# Altium schematic sheet ADF7020BCPZ-RL.SchDoc
size A3; SheetNumber: 9; SheetTotal: 9
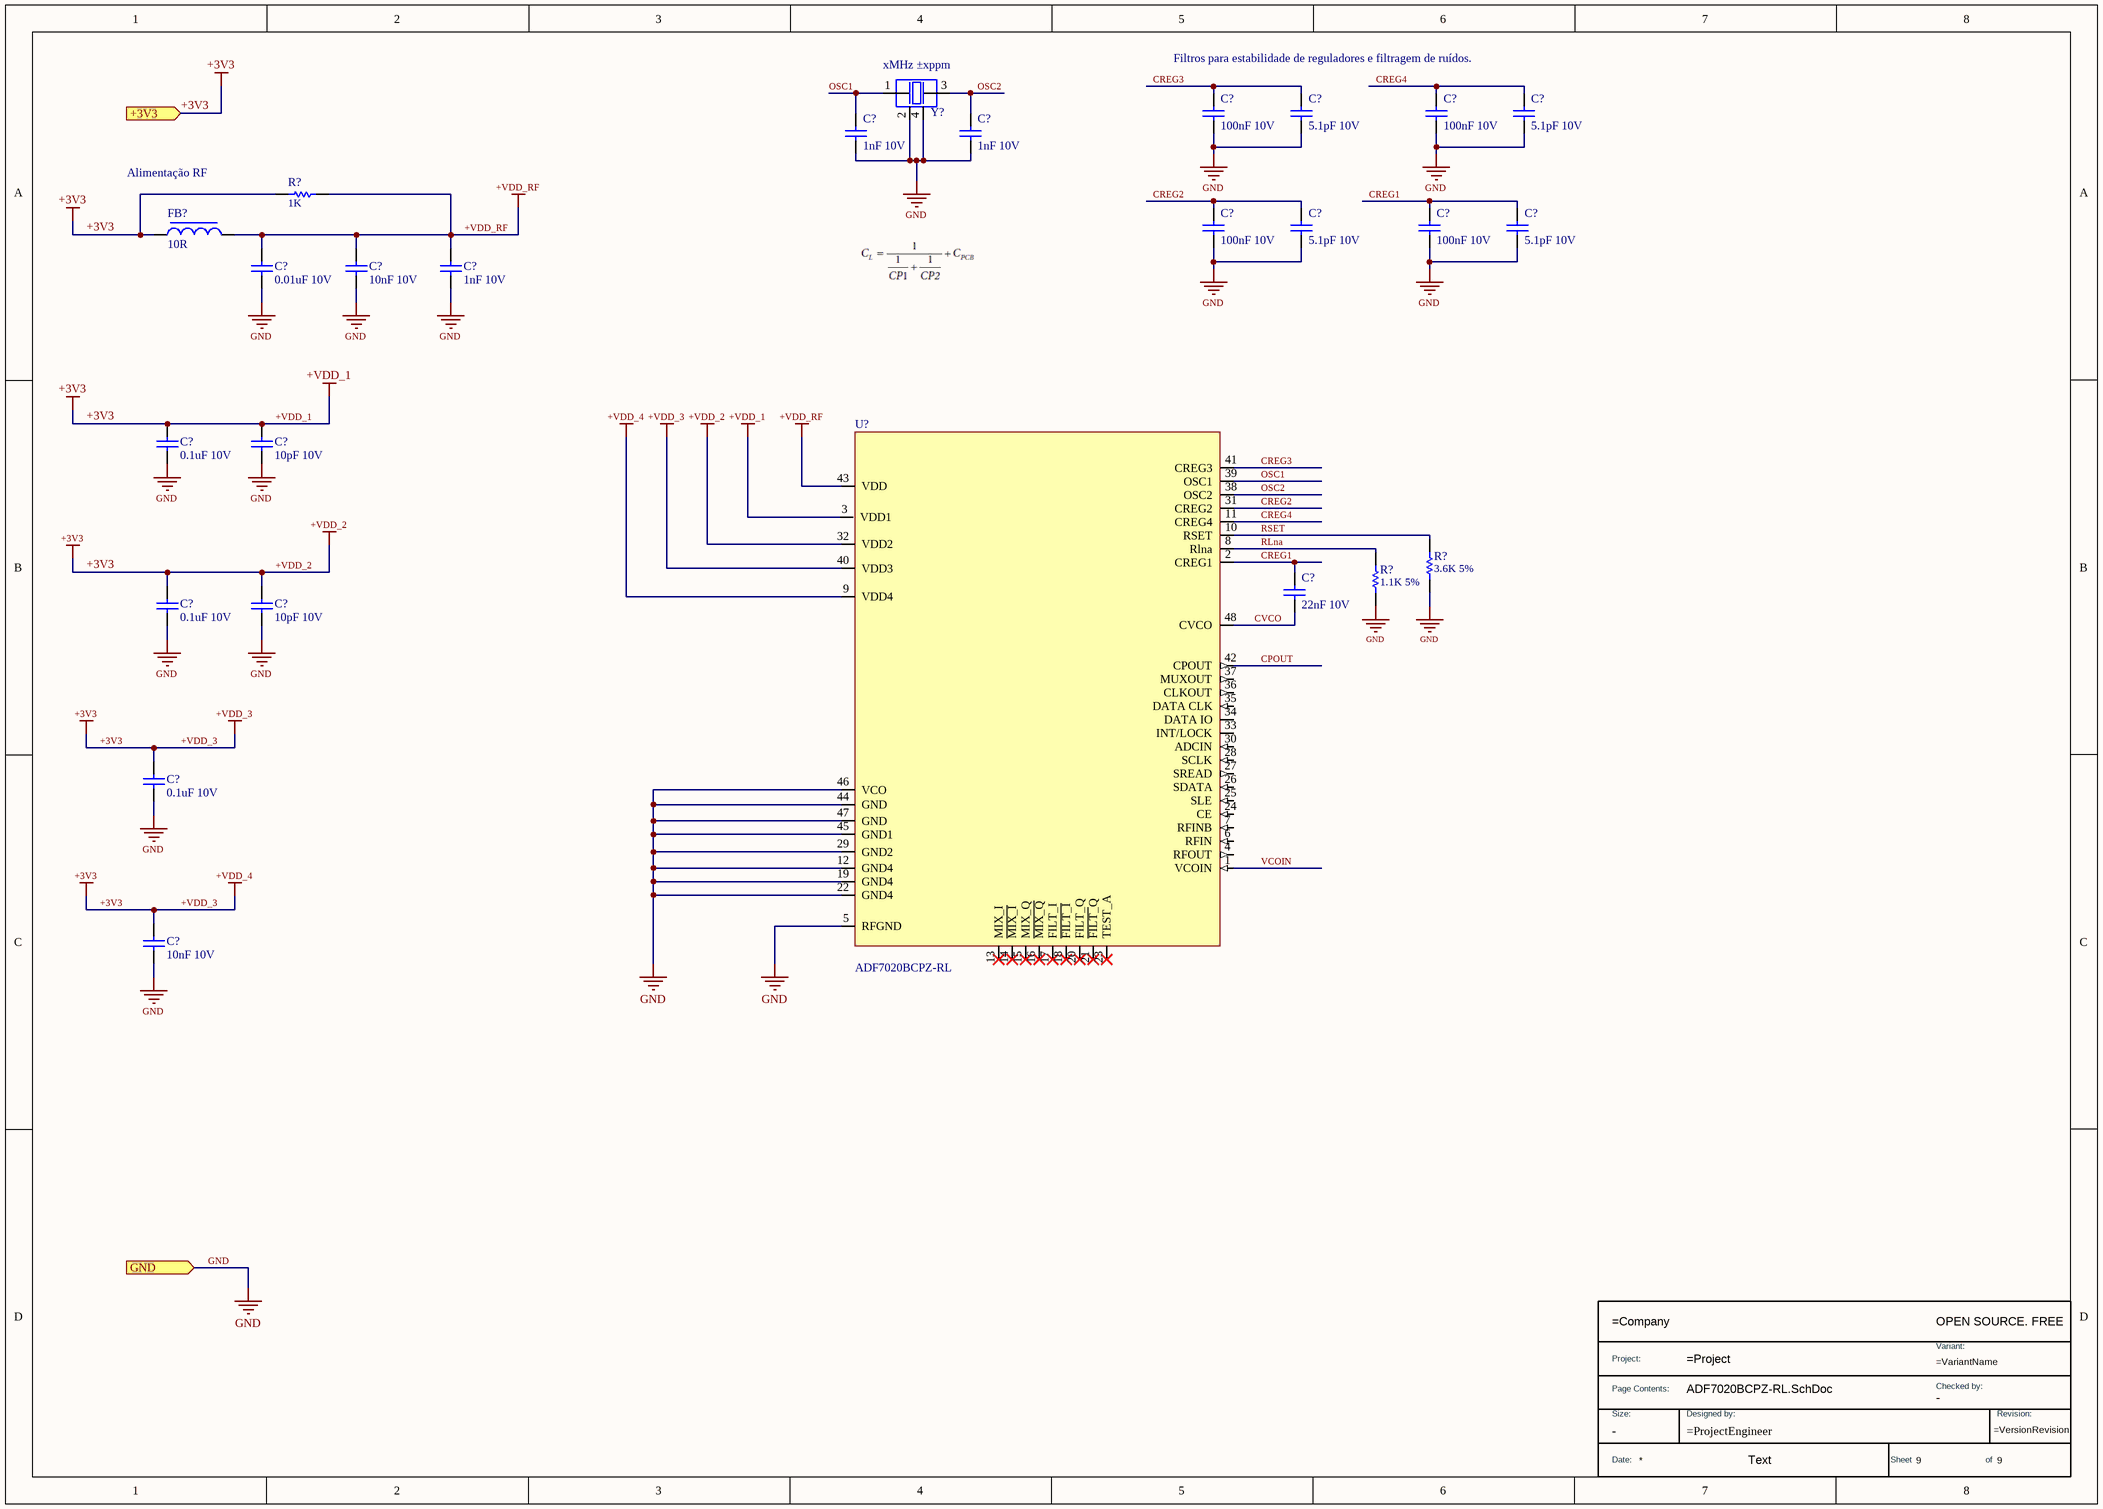
[diagram p0: ADF7020BCPZ-RL.SchDoc]

## Parts
(Parts that share a designator on the sheet are numbered #1, #2 ... from top to bottom, then left to right.)
*  TitleBlock  (value not drawn)  (graphical)
C?#1  value 100nF 10V  (hidden comment: _Capacitor)
C?#2  value 5.1pF 10V  (hidden comment: _Capacitor)
C?#3  value 100nF 10V  (hidden comment: _Capacitor)
C?#4  value 5.1pF 10V  (hidden comment: _Capacitor)
C?#5  value 1nF 10V  (hidden comment: _Capacitor)
C?#6  value 1nF 10V  (hidden comment: _Capacitor)
C?#7  value 100nF 10V  (hidden comment: _Capacitor)
C?#8  value 5.1pF 10V  (hidden comment: _Capacitor)
C?#9  value 100nF 10V  (hidden comment: _Capacitor)
C?#10  value 5.1pF 10V  (hidden comment: _Capacitor)
C?#11  value 0.01uF 10V  (hidden comment: _Capacitor)
C?#12  value 10nF 10V  (hidden comment: _Capacitor)
C?#13  value 1nF 10V  (hidden comment: _Capacitor)
C?#14  value 0.1uF 10V  (hidden comment: _Capacitor)
C?#15  value 10pF 10V  (hidden comment: _Capacitor)
C?#16  value 22nF 10V  (hidden comment: _Capacitor)
C?#17  value 0.1uF 10V  (hidden comment: _Capacitor)
C?#18  value 10pF 10V  (hidden comment: _Capacitor)
C?#19  value 0.1uF 10V  (hidden comment: _Capacitor)
C?#20  value 10nF 10V  (hidden comment: _Capacitor)
FB?  value 10R  (hidden comment: _FERRITE)
R?#1  value 1K  (hidden comment: _Resistor)
R?#2  value 3.6K 5%  (hidden comment: _Resistor)
R?#3  value 1.1K 5%  (hidden comment: _Resistor)
U?  ADF7020BCPZ-RL
Y?  Valor: xMHz ±xppm  (hidden comment: _Crystal)

## Ports
+3V3 (in, see 1[6B]), GND (in, see 1[3C], 2[4A], 4[1A])

## Nets
+3V3: C?#14.1 C?#15.1 C?#17.1 C?#18.1 C?#19.1 C?#20.1 FB?.1 R?#1.1 U?.3(VDD1) U?.9(VDD4) U?.32(VDD2) U?.40(VDD3) ; port +3V3  [also labelled +VDD_1, +VDD_2, +VDD_3, +VDD_4]
+VDD_RF: C?#11.1 C?#12.1 C?#13.1 FB?.2 R?#1.2 U?.43(VDD)
GND: C?#1.2 C?#2.2 C?#3.2 C?#4.2 C?#5.2 C?#6.2 C?#7.2 C?#8.2 C?#9.2 C?#10.2 C?#11.2 C?#12.2 C?#13.2 C?#14.2 C?#15.2 C?#17.2 C?#18.2 C?#19.2 C?#20.2 R?#2.1 R?#3.1 U?.5(RFGND) U?.12(GND4) U?.19(GND4) U?.22(GND4) U?.29(GND2) U?.44(GND) U?.45(GND1) U?.46(VCO) U?.47(GND) Y?.2 Y?.4 ; port GND
CPOUT: U?.42(CPOUT)
CREG1: C?#9.1 C?#10.1 C?#16.1 U?.2(CREG1)
CREG2: C?#7.1 C?#8.1 U?.31(CREG2)
CREG3: C?#1.1 C?#2.1 U?.41(CREG3)
CREG4: C?#3.1 C?#4.1 U?.11(CREG4)
CVCO: C?#16.2 U?.48(CVCO)
OSC1: C?#5.1 U?.39(OSC1) Y?.1
OSC2: C?#6.1 U?.38(OSC2) Y?.3
RLna: R?#3.2 U?.8(Rlna)
RSET: R?#2.2 U?.10(RSET)
VCOIN: U?.1(VCOIN)

Not connected (* = marked no-connect by the designer): U? 4(RFOUT) 6(RFIN) 7(RFINB) 13(MIX_I)* 14(~{MIX_I})* 15(MIX_Q)* 16(~{MIX_Q})* 17(FILT_I)* 18(~{FILT_I})* 20(FILT_Q)* 21(~{FILT_}Q)* 23(TEST_A)* 24(CE) 25(SLE) 26(SDATA) 27(SREAD) 28(SCLK) 30(ADCIN) 33(INT/LOCK) 34(DATA_IO) 35(DATA_CLK) 36(CLKOUT) 37(MUXOUT)

## Notes on the sheet
- (near C?#1) Filtros para estabilidade de reguladores e filtragem de ruídos.
- Alimentação RF
- Todas as informações e detalhes técnicos deste documento são de inteira propriedade da empresa V2COM,
- não poderão ser copiados, reduzidos ou cedidos a terceiros sem prévia autorização por escrito da mesma.
- Salvo em (D/M/A):
- Página:
- de
- Nome do Projeto:
- https://v2com.com/
- Ed.:
- Responsável:
- Nome da página:
- Rev.:
- Projetista:
- Obs.:
- Revisor:
- Arquivo:
- -
- (in symbol TitleBlock) OPEN SOURCE. FREE; Project:; Variant:; Page Contents:; Checked by:; Size:; Designed by:; Revision:; Date:; Text; Sheet; of

## Library data of the parts
* = TitleBlock: Standard Title Block; DWG NO: =ProjectEngineer; Size: -; Checked by: -
C?#1-C?#20 = _Capacitor: Capacitor; Published: 8-Jun-2000; LatestRevisionDate: 17-Jul-2002; LatestRevisionNote: Re-released for DXP Platform.; PackageReference: RAD-0.3; Publisher: Altium Limited; PackageDescription: Radial Cap, Thru-Hole; 2 Leads; 0.3 in Pin Spacing
FB? = _FERRITE: Ferrite Bead; Code_IEC: 1005; Published: 8-Jun-2000; LatestRevisionDate: 29-May-2009; LatestRevisionNote: IPC-7351 Footprint Added.; PackageReference: 0402-A; Publisher: Altium Limited; PackageDescription: Chip Inductor; Code_JEITA: 0402
R?#1-R?#3 = _Resistor: Resistor; Published: 8-Jun-2000; LatestRevisionDate: 17-Jul-2002; LatestRevisionNote: Re-released for DXP Platform.; PackageReference: AXIAL-0.3; Publisher: Altium Limited; PackageDescription: Axial Device, Thru-Hole; 2 Leads; 0.3 in Pin Spacing
U? = ADF7020BCPZ-RL: IC RF TXRX ISM<1GHZ 48VFQFN; Manufacturer: Analog Devices Inc.; Detailed Description: IC RF TxRx Only General ISM < 1GHz 431MHz ~ 478MHz, 862MHz ~ 956MHz 48-VFQFN Exposed Pad, CSP; Manufacturer Part Number: ADF7020BCPZ-RL
Y? = _Crystal: Crystal; Manufacturer: Diodes Incorporated; Manufacturer Part Number: FL2400022; Origem: MTER_Ed01r1; Case/Package: SMD; Observação: *